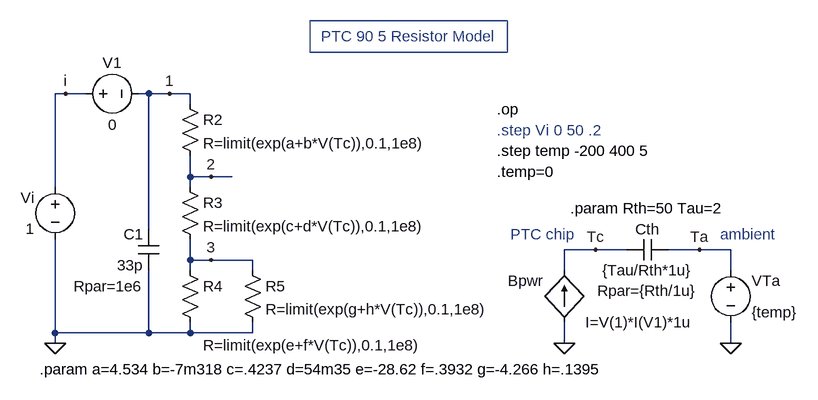
[diagram p0: schematic ptc90-5r.asc]
ptc90-5r.asc, the LTspice schematic file:
Version 4
SHEET 1 2228 1104
WIRE 896 -352 896 -496
WIRE 896 -128 896 -272
WIRE 896 -112 896 -128
WIRE 912 -496 896 -496
WIRE 944 -496 912 -496
WIRE 1040 -496 1024 -496
WIRE 1040 -288 1040 -496
WIRE 1040 -128 896 -128
WIRE 1040 -128 1040 -224
WIRE 1072 -496 1040 -496
WIRE 1104 -496 1072 -496
WIRE 1104 -480 1104 -496
WIRE 1104 -368 1104 -400
WIRE 1104 -352 1104 -368
WIRE 1104 -240 1104 -272
WIRE 1104 -224 1104 -240
WIRE 1104 -128 1040 -128
WIRE 1104 -128 1104 -144
WIRE 1136 -368 1104 -368
WIRE 1136 -240 1104 -240
WIRE 1168 -368 1136 -368
WIRE 1200 -240 1136 -240
WIRE 1200 -224 1200 -240
WIRE 1200 -128 1104 -128
WIRE 1200 -128 1200 -144
WIRE 1680 -224 1680 -256
WIRE 1680 -112 1680 -144
WIRE 1728 -256 1680 -256
WIRE 1776 -256 1728 -256
WIRE 1888 -256 1840 -256
WIRE 1936 -256 1888 -256
WIRE 1936 -224 1936 -256
WIRE 1936 -112 1936 -144
FLAG 1072 -496 1
FLAG 1936 -112 0
FLAG 1680 -112 0
FLAG 1728 -256 Tc
FLAG 896 -112 0
FLAG 1888 -256 Ta
FLAG 1136 -368 2
FLAG 1136 -240 3
FLAG 912 -496 i
SYMBOL voltage 896 -368 M0
WINDOW 123 0 0 Left 0
WINDOW 39 0 0 Left 0
WINDOW 0 32 32 Left 0
WINDOW 3 32 80 Left 0
SYMATTR InstName Vi
SYMATTR Value 1
SYMBOL bi 1680 -144 R180
WINDOW 0 32 64 Left 0
WINDOW 3 -32 0 Right 0
SYMATTR InstName Bpwr
SYMATTR Value I=V(1)*I(V1)*1u
SYMBOL voltage 1936 -240 R0
WINDOW 0 32 32 Left 0
WINDOW 3 32 80 Left 0
SYMATTR InstName VTa
SYMATTR Value {temp}
SYMBOL voltage 928 -496 M90
WINDOW 0 -32 56 VBottom 0
WINDOW 3 32 56 VTop 0
SYMATTR InstName V1
SYMATTR Value 0
SYMBOL cap 1840 -272 R90
WINDOW 0 0 32 VBottom 0
WINDOW 3 32 32 VTop 0
WINDOW 39 64 32 VTop 0
SYMATTR InstName Cth
SYMATTR Value {Tau/Rth*1u}
SYMATTR SpiceLine Rpar={Rth/1u}
SYMBOL cap 1056 -288 M0
WINDOW 3 24 56 Left 0
WINDOW 39 24 88 Left 0
SYMATTR Value 33p
SYMATTR SpiceLine Rpar=1e6
SYMATTR InstName C1
SYMBOL res 1088 -496 R0
SYMATTR InstName R2
SYMATTR Value R=limit(exp(a+b*V(Tc)),0.1,1e8)
SYMBOL res 1088 -368 R0
SYMATTR InstName R3
SYMATTR Value R=limit(exp(c+d*V(Tc)),0.1,1e8)
SYMBOL res 1088 -240 R0
WINDOW 3 36 131 Left 0
SYMATTR Value R=limit(exp(e+f*V(Tc)),0.1,1e8)
SYMATTR InstName R4
SYMBOL res 1184 -240 R0
SYMATTR InstName R5
SYMATTR Value R=limit(exp(g+h*V(Tc)),0.1,1e8)
TEXT 1576 -440 Left 0 ;.step Vi 0 50 .2
TEXT 1808 -320 Center 0 !.param Rth=50 Tau=2
TEXT 1576 -408 Left 0 !.step temp -200 400 5
TEXT 872 -72 Left 0 !.param a=4.534 b=-7m318 c=.4237 d=54m35 e=-28.62 f=.3932 g=-4.266 h=.1395
TEXT 1576 -472 Left 0 !.op
TEXT 1576 -376 Left 0 !.temp=0
TEXT 1440 -584 Center 0 ;PTC 90 5 Resistor Model
TEXT 1920 -280 Left 0 ;ambient
TEXT 1696 -280 Right 0 ;PTC chip
RECTANGLE Normal 1592 -560 1288 -608

The netlist it stands for:
* ptc90-5r.asc
Vi i 0 1
Bpwr 0 Tc I=V(1)*I(V1)*1u
VTa Ta 0 {temp}
V1 i 1 0
Cth Ta Tc {Tau/Rth*1u} Rpar={Rth/1u}
C1 1 0 33p Rpar=1e6
R2 1 2 R=limit(exp(a+b*V(Tc)),0.1,1e8)
R3 2 3 R=limit(exp(c+d*V(Tc)),0.1,1e8)
R4 3 0 R=limit(exp(e+f*V(Tc)),0.1,1e8)
R5 3 0 R=limit(exp(g+h*V(Tc)),0.1,1e8)
* .step Vi 0 50 .2
.param Rth=50 Tau=2
.step temp -200 400 5
.param a=4.534 b=-7m318 c=.4237 d=54m35 e=-28.62 f=.3932 g=-4.266 h=.1395
.op
.temp=0
* PTC 90 5 Resistor Model
* ambient
* PTC chip
.backanno
.end